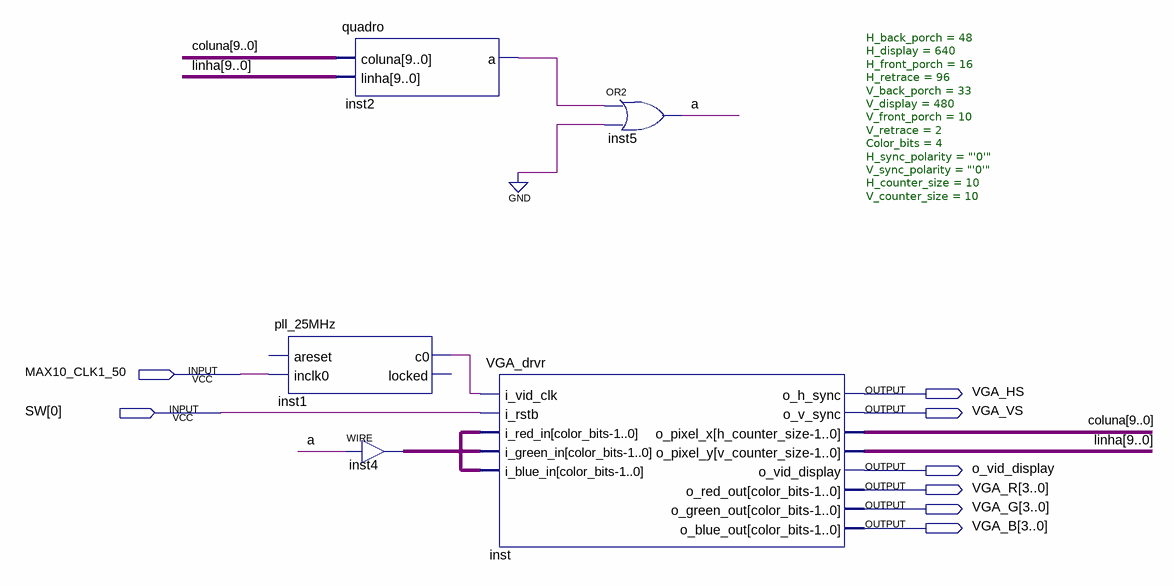
[diagram p0: schematic sheet]
// Quartus schematic vga1.bdf as structural Verilog: 5 symbols, 8 pins
module vga1 (
  input  MAX10_CLK1_50,
  input  [0:0] SW,
  output VGA_HS,
  output VGA_VS,
  output o_vid_display,
  output [3:0] VGA_R,
  output [3:0] VGA_G,
  output [3:0] VGA_B
);

  wire a, inst1_c0, inst2_a;
  wire [3:0] inst4_out;
  wire [9:0] coluna, linha;

  pll_25MHz inst1 (.inclk0(MAX10_CLK1_50), .c0(inst1_c0));  // open: areset, locked
  quadro inst2 (.coluna(coluna), .linha(linha), .a(inst2_a));
  assign inst4_out = {4{a}};  // WIRE inst4
  VGA_drvr #(.H_back_porch(48), .H_display(640), .H_front_porch(16), .H_retrace(96), .V_back_porch(33), .V_display(480), .V_front_porch(10), .V_retrace(2), .Color_bits(4), .H_sync_polarity("'0'"), .V_sync_polarity("'0'"), .H_counter_size(10), .V_counter_size(10)) inst (
    .i_vid_clk(inst1_c0), .i_rstb(SW[0]), .i_red_in(inst4_out), .i_green_in(inst4_out),
    .i_blue_in(inst4_out), .o_h_sync(VGA_HS), .o_v_sync(VGA_VS), .o_pixel_x(coluna), .o_pixel_y(linha),
    .o_vid_display(o_vid_display), .o_red_out(VGA_R), .o_green_out(VGA_G), .o_blue_out(VGA_B));
  or inst5 (a, inst2_a, 1'b0);
endmodule
